# Altium project CZ201E_V2.0.PrjPCB
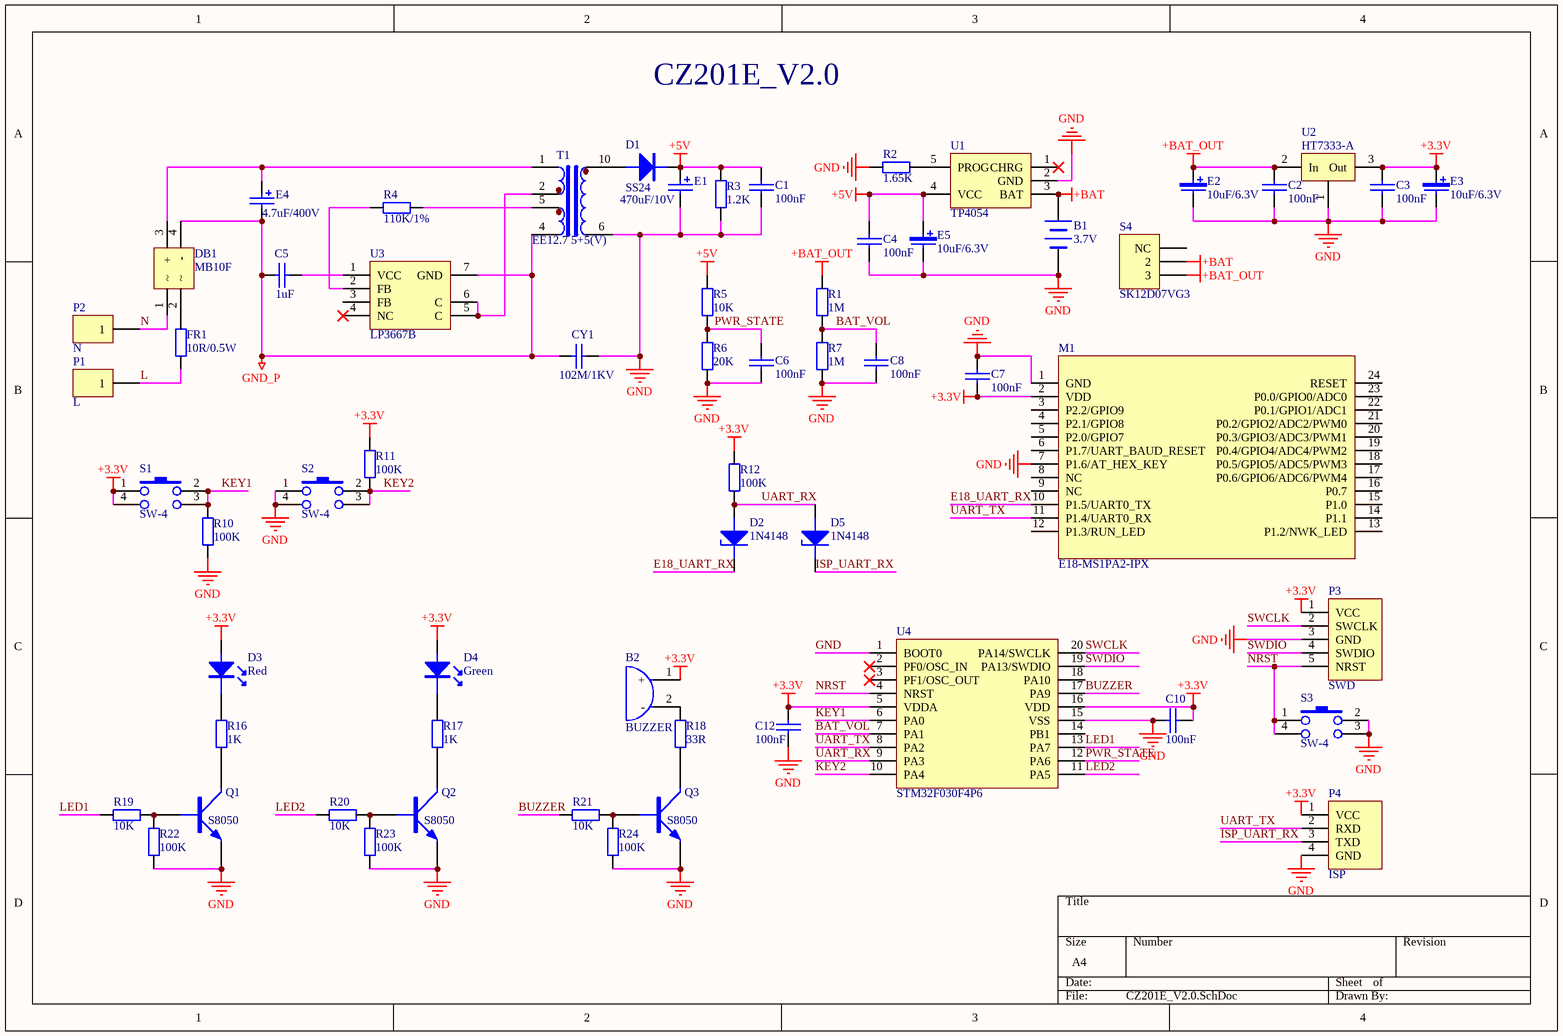
[diagram p0: CZ201E_V2.0.SchDoc]
1 sheet, 61 parts. Net scope: global (net labels, ports and power ports of the same name join across sheets).
Board files: CZ201E_V2.0.PcbDoc, CZ201E_Weld_V2.0.PcbDoc

## Sheet CZ201E_V2.0.SchDoc
size A4

### Parts
B1  3.7V  [XH2.54-2P-BAT]
B2  BUZZER  [BEEZ]
C1  100nF  [0603_CN]
C2  100nF  [0603_CN]
C3  100nF  [0603_CN]
C4  100nF  [0603_CN]
C5  1uF  [0603_CN]
C6  100nF  [0603_CN]
C7  100nF  [0603_CN]
C8  100nF  [0603_CN]
C10  100nF  [0603_CN]
C12  100nF  [0603_CN]
CY1  102M/1KV  [CY-5MM]
D1  SS24  [DO-214AC(SMA)]
D2  1N4148  [LL-34]
D3  Red  [0603_LED]
D4  Green  [0603_LED]
D5  1N4148  [LL-34]
DB1  MB10F  [MB10F]
E1  470uF/10V  [CS_470uF/16V]
E2  10uF/6.3V  [3216_E]
E3  10uF/6.3V  [3216_E]
E4  4.7uF/400V  [CS_220uF/25V]
E5  10uF/6.3V  [3216_E]
FR1  10R/0.5W  [R0.12L]
M1  E18-MS1PA2-IPX  [E18-MS1PA2-IPX]
P1  L  [CP3M-6*5*8.5MM]
P2  N  [CP3M-6*5*8.5MM]
P3  SWD  [XH2.54-5P]
P4  ISP  [XH2.54-4P]
Q1  S8050  [SOT-23]
Q2  S8050  [SOT-23]
Q3  S8050  [SOT-23]
R1  1M  [0603_RN]
R2  1.65K  [0603_RN]
R3  1.2K  [0603_RN]
R4  110K/1%  [0603_RN]
R5  10K  [0603_RN]
R6  20K  [0603_RN]
R7  1M  [0603_RN]
R10  100K  [0603_RN]
R11  100K  [0603_RN]
R12  100K  [0603_RN]
R16  1K  [0603_RN]
R17  1K  [0603_RN]
R18  33R  [0603_RN]
R19  10K  [0603_RN]
R20  10K  [0603_RN]
R21  10K  [0603_RN]
R22  100K  [0603_RN]
R23  100K  [0603_RN]
R24  100K  [0603_RN]
S1  SW-4  [KEY-6*6MM-DIP]
S2  SW-4  [KEY-6*6MM-DIP]
S3  SW-4  [KEY-4*4*1.5MM-SMD]
S4  SK12D07VG3  [SK12D07VG3]
T1  EE12.7 5+5(V)  [EE12.7 5+5(V)]
U1  TP4054  [SOT-23-5]
U2  HT7333-A  [SOT-89]
U3  LP3667B  [SOP7]
U4  STM32F030F4P6  [TSSOP20]

### Nets
+3.3V: B2.1(+) C3.1 C7.2 C10.1 C12.1 D3.A D4.A E3.1 M1.2(VDD) P3.1(VCC) P4.1(VCC) R11.2 R12.2 S1.1 S1.4 U2.3(Out) U4.5(VDDA) U4.16(VDD)
+5V: C1.1 C4.1 D1.K E1.1 E5.1 R3.2 R5.2 U1.4(VCC)
+BAT: B1.1(+) S4.2 U1.3(BAT)
+BAT_OUT: C2.1 E2.1 R1.2 S4.3 U2.2(In)
GND: B1.2(-) C1.2 C2.2 C3.2 C4.2 C6.2 C7.1 C8.2 C10.2 C12.2 CY1.2 E1.2 E2.2 E3.2 E5.2 M1.1(GND) M1.7(P1.6/AT_HEX_KEY) P3.3(GND) P4.4(GND) Q1.2(E) Q2.2(E) Q3.2(E) R2.1 R3.1 R6.1 R7.1 R10.1 R22.1 R23.1 R24.1 S2.1 S2.4 S3.2 S3.3 T1.6(Ns) U1.2(GND) U2.1(GND) U4.1(BOOT0) U4.15(VSS)
GND_P: C5.2 CY1.1 DB1.4(-) E4.2 T1.4(Nd) U3.7(GND)
BAT_VOL: C8.1 R1.1 R7.2 U4.7(PA1)
BUZZER: R21.2 U4.17(PA9)
E18_UART_RX: D2.K M1.10(P1.5/UART0_TX)
ISP_UART_RX: D5.K P4.3(TXD)
KEY1: R10.2 S1.2 S1.3 U4.6(PA0)
KEY2: R11.1 S2.2 S2.3 U4.10(PA4)
L: FR1.1 P1.1
LED1: R19.2 U4.13(PA7)
LED2: R20.2 U4.11(PA5)
N: DB1.1 P2.1
NRST: P3.5(NRST) S3.1 S3.4 U4.4(NRST)
PWR_STATE: C6.1 R5.1 R6.2 U4.12(PA6)
SWCLK: P3.2(SWCLK) U4.20(PA14/SWCLK)
SWDIO: P3.4(SWDIO) U4.19(PA13/SWDIO)
UART_RX: D2.A D5.A R12.1 U4.9(PA3)
UART_TX: M1.11(P1.4/UART0_RX) P4.2(RXD) U4.8(PA2)
NetB2_2: B2.2(-) R18.2
NetC5_1: C5.1 U3.1(VCC)
NetD1_A: D1.A T1.10(Ns)
NetD3_K: D3.K R16.2
NetD4_K: D4.K R17.2
NetDB1_2: DB1.2 FR1.2
NetDB1_3: DB1.3(+) E4.1 T1.1(Np)
NetQ1_1: Q1.1(B) R19.1 R22.2
NetQ1_3: Q1.3(C) R16.1
NetQ2_1: Q2.1(B) R20.1 R23.2
NetQ2_3: Q2.3(C) R17.1
NetQ3_1: Q3.1(B) R21.1 R24.2
NetQ3_3: Q3.3(C) R18.1
NetR2_2: R2.2 U1.5(PROG)
NetR4_1: R4.1 U3.2(FB)
NetR4_2: R4.2 T1.5(Nd)
NetT1_2: T1.2(Np) U3.5(C) U3.6(C)

Not connected (* = marked no-connect by the designer): M1 3(P2.2/GPIO9) 4(P2.1/GPIO8) 5(P2.0/GPIO7) 6(P1.7/UART_BAUD_RESET) 8(NC) 9(NC) 12(P1.3/RUN_LED) 13(P1.2/NWK_LED) 14(P1.1) 15(P1.0) 16(P0.7) 17(P0.6/GPIO6/ADC6/PWM4) 18(P0.5/GPIO5/ADC5/PWM3) 19(P0.4/GPIO4/ADC4/PWM2) 20(P0.3/GPIO3/ADC3/PWM1) 21(P0.2/GPIO2/ADC2/PWM0) 22(P0.1/GPIO1/ADC1) 23(P0.0/GPIO0/ADC0) 24(RESET); S4 1(NC); U1 1(CHRG)*; U3 3(FB) 4(NC)*; U4 2(PF0/OSC_IN)* 3(PF1/OSC_OUT)* 14(PB1) 18(PA10)

### Notes on the sheet
- CZ201E_V2.0

### Library data of the parts
B1 = BATTERY
C1-C8 C10 C12 CY1 = Cap1
D1 = Diode-A: SS14,SS24,SS34,M7
D2 D5 = Diode-B
D3 D4 = LED
DB1 = MB10F: component: Bridge Rectifiers; withstand voltage: 1000V; output current: 1A
E1 E4 = Cap Pol1: CS_100uF/16V: D=5mm , PIN Spacing= 2mm; CS_1000uF/16V: D=10mm , PIN Spacing= 3.5mm; CS_470uF/16V: D=8mm , PIN Spacing= 3.5mm; CS_100uF/25V: D=6.3mm , PIN Spacing= 2.5mm; CS_470uF/25V: D=10mm , PIN Spacing= 3.5mm; CS_1000uF/25V: D=10mm , PIN Spacing= 3.5mm; CS_220uF/25V: D=8mm , PIN Spacing= 3.5mm; CS_220uF/16V: D=6.3mm , PIN Spacing= 2.5mm; CS_47uF/25V: D=5mm , PIN Spacing= 2mm
E2 E3 E5 = Cap Ta: 0805_E: *; 7361_E: *; 3528_E: *; 7343_E: *; 3216_E: *; 6032_E: *
FR1 R1-R7 R10-R12 R16-R24 = Res1: Name: Resistor; Power: 0210(1/20W 25V), 0402(1/16W  50V),0603(1/16W  50V),0805(1/10W  150V),1206(1/8W  200V),1210(1/4W  200V),1812(1/2W  200V),2010(1/2W  200V),2512(1W  200V),
P1 P2 = Header 1: Header, 1-Pin; LatestRevisionDate: 17-Jul-2002; LatestRevisionNote: Re-released for DXP Platform.; Publisher: Altium Limited
P4 = ISP_UART
Q1-Q3 = 8050
U1 = QX4054: TP4054,LTC4054 ,PJ4054MR
U2 = HT7833: HT7533; Output 500mA; Iq: 5uA, max= 7uA
U3 = LP3667B: LP3667A, LP3667B, LP3667AH, LP3667BH